# EAGLE design PCBArduino (EAGLE 9.4.2)
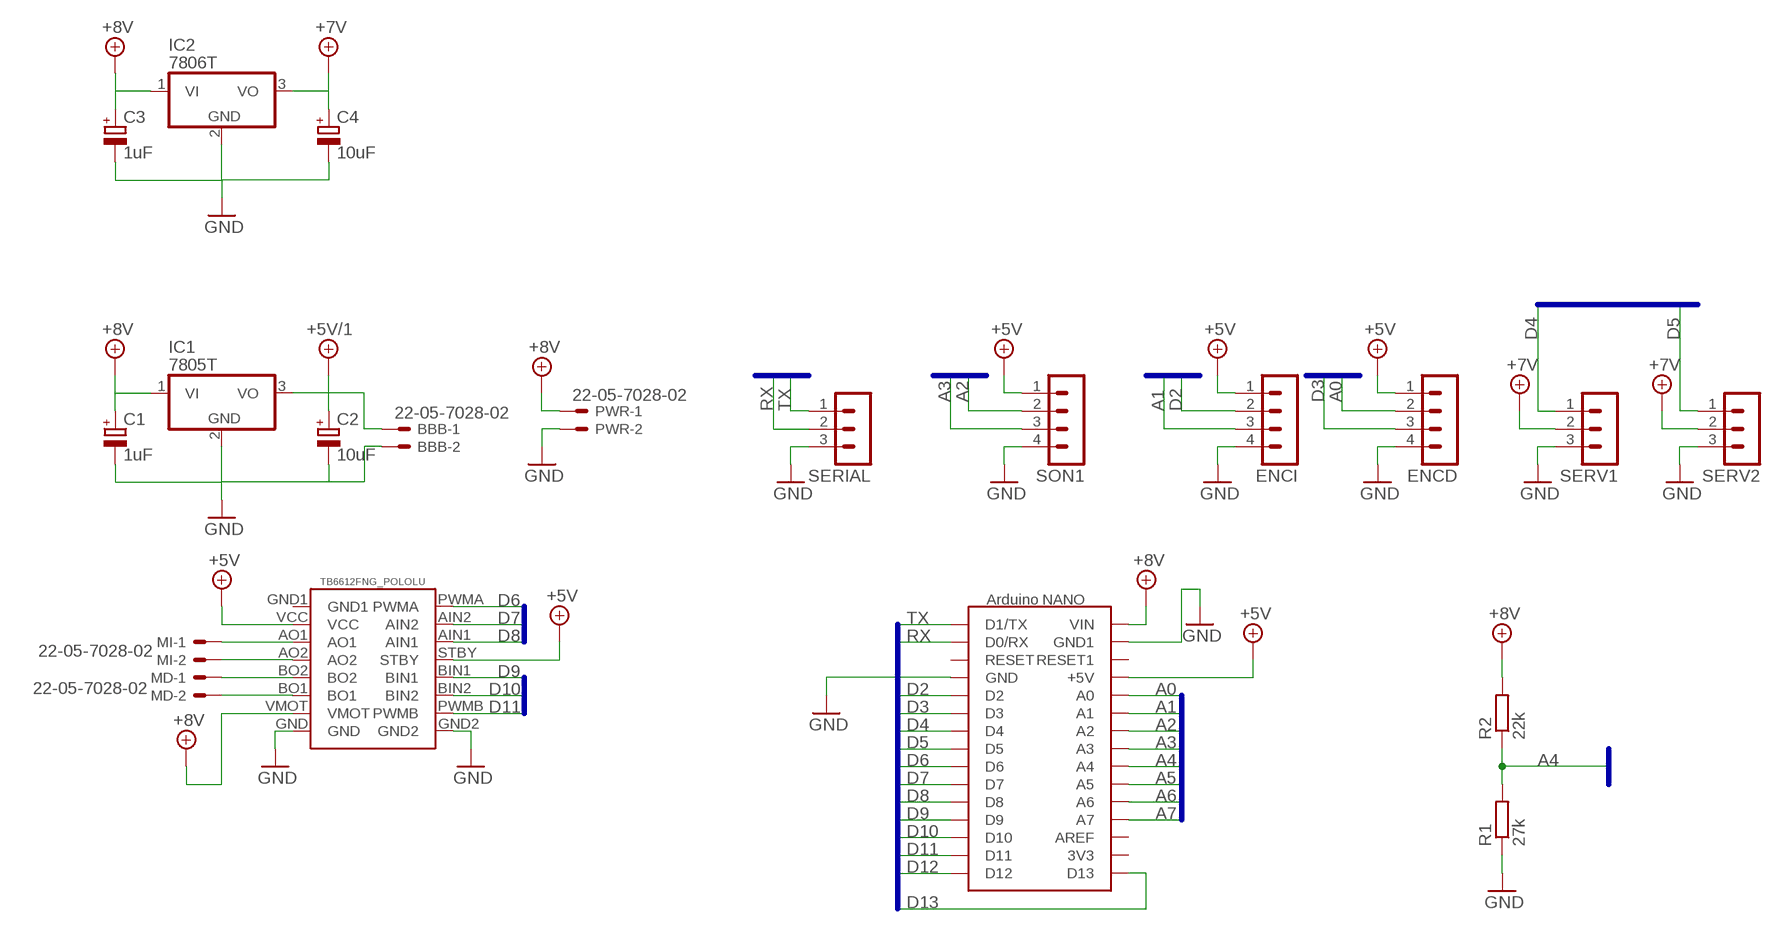
[diagram p0: schematic, sheet 1]

## Parts
BBB  22-05-7028-02  [7395-02]
C1  1uF  CPOL-EUE2.5-7  [E2,5-7]
C2  10uF  CPOL-EUE2.5-7  [E2,5-7]
C3  1uF  CPOL-EUE2.5-7  [E2,5-7]
C4  10uF  CPOL-EUE2.5-7  [E2,5-7]
ENCD  MA04-1  [MA04-1]
ENCI  MA04-1  [MA04-1]
IC1  7805T  [TO220H]
IC2  7806T  [TO220H]
MD  22-05-7028-02  [7395-02]
MI  22-05-7028-02  [7395-02]
PWR  22-05-7028-02  [7395-02]
R1  27k  R-EU_0204/5  [0204/5]
R2  22k  R-EU_0204/5  [0204/5]
SERIAL  MA03-1  [MA03-1]
SERV1  MA03-1  [MA03-1]
SERV2  MA03-1  [MA03-1]
SON1  MA04-1  [MA04-1]
U$1  ARDUINONANO  [PDIP-32]
U$2  TB6612FNG_POLOLU  [TB6612FNG_POLOLU]

## Nets
+5V: ENCD.1 ENCI.1 SON1.1 U$1.+5V U$2.STBY U$2.VCC
+5V/1: BBB.1 C2.+ IC1.3(VO)
+7V: C4.+ IC2.3(VO) SERV1.2 SERV2.2
+8V: C1.+ C3.+ IC1.1(VI) IC2.1(VI) PWR.1 R2.2 U$1.VIN U$2.VMOT
A0: ENCD.2 U$1.A0
A1: ENCI.3 U$1.A1
A2: SON1.2 U$1.A2
A3: SON1.3 U$1.A3
A4: R1.2 R2.1 U$1.A4
A5: U$1.A5
A6: U$1.A6
A7: U$1.A7
D2: ENCI.2 U$1.D2
D3: ENCD.3 U$1.D3
D4: SERV1.1 U$1.D4
D5: SERV2.1 U$1.D5
D6: U$1.D6 U$2.PWMA
D7: U$1.D7 U$2.AIN2
D8: U$1.D8 U$2.AIN1
D9: U$1.D9 U$2.BIN1
D10: U$1.D10 U$2.BIN2
D11: U$1.D11 U$2.PWMB
D12: U$1.D12
D13: U$1.D13
GND: BBB.2 C1.- C2.- C3.- C4.- ENCD.4 ENCI.4 IC1.2(GND) IC2.2(GND) PWR.2 R1.1 SERIAL.3 SERV1.3 SERV2.3 SON1.4 U$1.GND U$1.GND1 U$2.GND U$2.GND2
N$1: MI.1 U$2.AO1
N$2: MI.2 U$2.AO2
N$3: MD.1 U$2.BO2
N$4: MD.2 U$2.BO1
RX: SERIAL.2 U$1.D0/RX
TX: SERIAL.1 U$1.D1/TX
Unconnected: U$1.3V3 U$1.AREF U$1.RESET U$1.RESET1 U$2.GND1

## Buses
TX,RX,D2,D3,D4,D5,D6,D7,D8,D9,D10,D11,D12,D13,A0,A1,A2,A3,A4,A5,A6,A7
A0,A1,A2,A3,A4,A5,A6,A7

## Library data of the parts
BBB MD MI PWR = con-molex:22-?-02: CONNECTOR wire to board 2.54 mm (.1 inch) pitch header; OC_FARNELL: 9731601; OC_NEWARK: unknown
C1-C4 = rcl:CPOL-EU: POLARIZED CAPACITOR, European symbol
ENCD ENCI SON1 = con-lstb:MA04-1: PIN HEADER; OC_FARNELL: unknown; OC_NEWARK: unknown
IC1 IC2 = linear:78*: Positive VOLTAGE REGULATOR Source: http://cache.national.com/ds/LM/LM78L05.pdf http://www.fairchildsemi.com/ds/LM/LM7805.pdf
R1 R2 = rcl:R-EU_: RESISTOR, European symbol
SERIAL SERV1 SERV2 = con-lstb:MA03-1: PIN HEADER; OC_FARNELL: unknown; OC_NEWARK: unknown
U$1 = jet-lib:ARDUINONANO
U$2 = Crofi_UNAM_2014-11-17:TB6612FNG_POLOLU

## Board
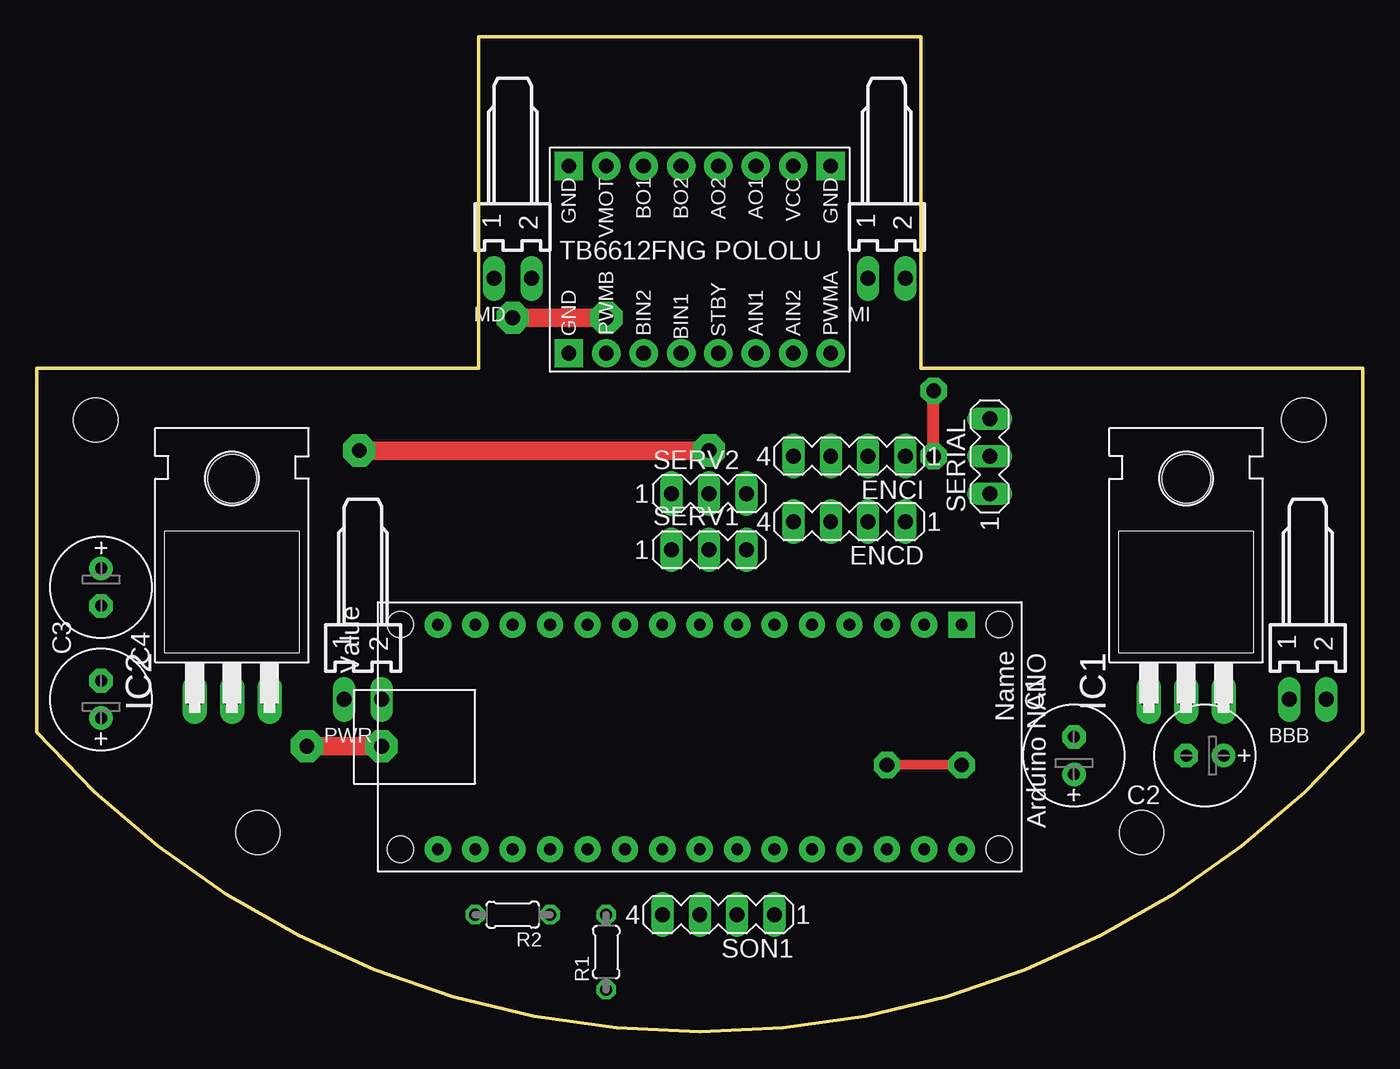
[diagram p1: board, top side]
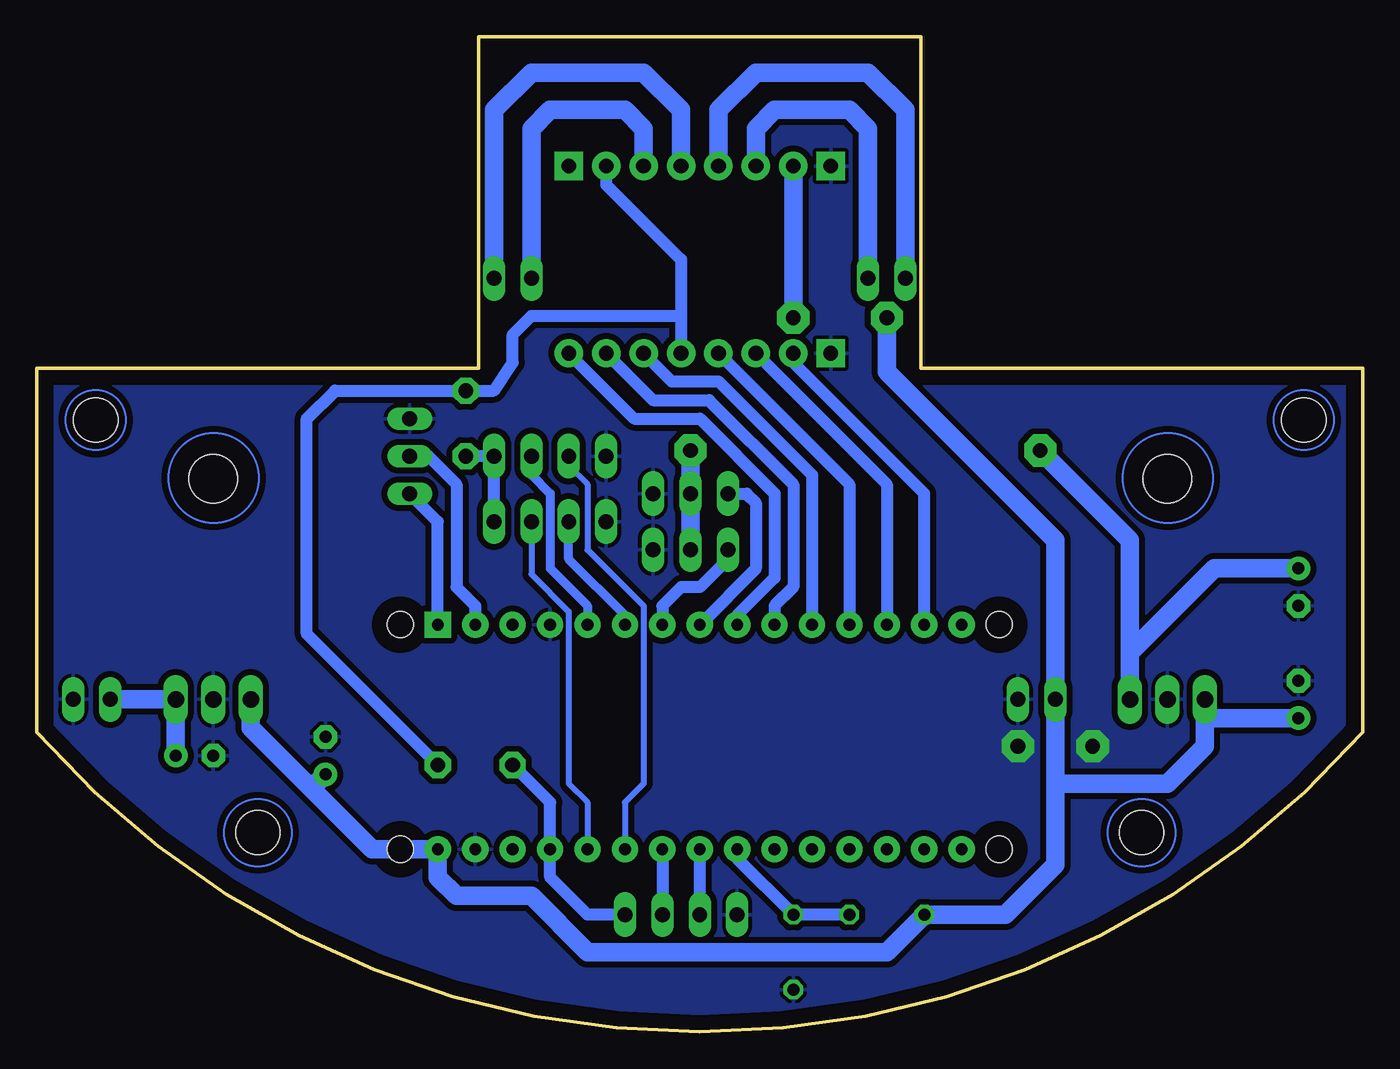
[diagram p2: board, bottom side, seen from below]

Size 90 x 67.52 mm. Coordinates in mm from the lower left corner, seen from the top.
Outline: 0,20.32 0,45.02 30,45.02 30,67.52 60,67.52 60,45.02 90,45.02 90,20.32 arc-97 0,20.32
Copper layers (1*16): Top 0.035mm / dielectric 1.5mm / Bottom 0.035mm
Design rules "default": minimum track width 10mil, minimum drill 24mil, track to track 8mil, track to pad 8mil, pad to pad 8mil, via to via 8mil, smd to smd 8mil, copper to edge 40mil, drill to drill 8mil, minimum pad ring 10mil, minimum via ring 8mil, stop-mask expansion 4mil, vias tented up to drill 0mil, thermal gap 10mil
Holes 3 mm at 15,13.52 4,41.52 86,41.52 75,13.52

### Footprints (pad centres in the part's own frame; a part is rotated, then mirrored left to right if it is on the bottom)
7395-02 = drill 1.016 long: 1 1.27,0; 2 -1.27,0
E2,5-7 = drill 0.813 pad 1.6: + -1.27,0 | drill 0.813 pad 1.6 octagon: - 1.27,0
MA04-1 = drill 1.016 long: 1 -3.81,0; 2 -1.27,0; 3 1.27,0; 4 3.81,0
TO220H = drill 1.118 long: 1 -2.54,-10.16; 2 0,-10.16; 3 2.54,-10.16 | hole 3.302: 0,4.826
0204/5 = drill 0.813 octagon: 1 -2.54,0; 2 2.54,0
MA03-1 = drill 1.016 long: 1 -2.54,0; 2 0,0; 3 2.54,0
PDIP-32 = drill 0.8 pad 1.778: 3V3 15.24,-35.56; +5V 15.24,-10.16; A0 15.24,-12.7; A1 15.24,-15.24; A2 15.24,-17.78; A3 15.24,-20.32; A4 15.24,-22.86; A5 15.24,-25.4; A6 15.24,-27.94; A7 15.24,-30.48; AREF 15.24,-33.02; D0/RX 0,-5.08; D2 0,-12.7; D3 0,-15.24; D4 0,-17.78; D5 0,-20.32; D6 0,-22.86; D7 0,-25.4; D8 0,-27.94; D9 0,-30.48; D10 0,-33.02; D11 0,-35.56; D12 0,-38.1; D13 15.24,-38.1; GND 0,-10.16; GND1 15.24,-5.08; RESET 0,-7.62; RESET1 15.24,-7.62; VIN 15.24,-2.54 | drill 0.8 pad 1.778 square: D1/TX 0,-2.54 | hole 1.778: 0,0; 0,-40.64; 15.24,-40.64; 15.24,0
TB6612FNG_POLOLU = drill 1 pad 1.93: AIN1 13.97,13.97; AIN2 13.97,16.51; AO1 1.27,13.97; AO2 1.27,11.43; BIN1 13.97,8.89; BIN2 13.97,6.35; BO1 1.27,6.35; BO2 1.27,8.89; PWMA 13.97,19.05; PWMB 13.97,3.81; STBY 13.97,11.43; VCC 1.27,16.51; VMOT 1.27,3.81 | drill 1 pad 1.93 square: GND 1.27,1.27; GND1 1.27,19.05; GND2 13.97,1.27

### Placement (x,y rotation side)
BBB  86.28,22.55 180 top
C1  70.4,18.74 90 top
C2  79.29,18.74 180 top
C3  4.36,22.55 90 top
C4  4.36,30.17 270 top
ENCD  55.16,34.62 180 top
ENCI  55.16,39.06 180 top
IC1  78.02,32.71 0 top
IC2  13.25,32.71 0 top
MD  32.3,51.13 180 top
MI  57.7,51.13 180 top
PWR  22.14,22.55 180 top
R1  38.65,5.41 90 top
R2  32.3,7.95 180 top
SERIAL  64.69,39.06 90 top
SERV1  45.63,32.71 0 top
SERV2  45.63,36.52 0 top
SON1  46.27,7.95 180 top
U$1  65.32,27.63 270 top
U$2  34.84,60.02 270 top

### Tracks (layer width: path | path; a pad name or v marks a point on that pad's centre or on a via)
+5V  (via drill 1 pad 1.78)
  Top 0.635: v57.7,18.11 v62.78,18.11
  Top 0.813: v60.88,39.06 v60.88,43.51
  Bottom 0.813: SON1.1 52.62,7.95 55.16,10.49 U$1.+5V 55.16,15.57 v57.7,18.11 | U$2.VCC 51.35,57.48 46.27,52.4 46.27,48.59 | 46.27,48.59 U$2.STBY | v62.78,18.11 71.67,27 71.67,41.6 69.77,43.51 v60.88,43.51 58.97,43.51 57.7,45.41 57.7,47.32 56.43,48.59 46.27,48.59 | ENCD.1 ENCI.1 v60.88,39.06
+5V/1
  Bottom 1.27: BBB.1 IC1.3 C2.+
+7V  (via drill 1 pad 2.18)
  Top 1.27: v21.89,39.44 v45.63,39.44
  Bottom 1.27: C4.+ 10.08,31.44 15.79,25.73 | 15.79,25.73 IC2.3 | 15.79,25.73 15.79,33.35 v21.89,39.44 | SERV1.2 SERV2.2 v45.63,39.44
+8V  (via drill 1 pad 2.18)
  Top 1.27: v32.3,48.46 v38.65,48.46
  Bottom 1.27: v32.3,48.46 32.3,44.78 20.87,33.35 PWR.1 20.87,16.84 | v38.65,48.46 U$2.VMOT | IC1.1 75.48,20.65 71.67,16.84 | 71.67,16.84 67.22,12.39 U$1.VIN 62.78,10.49 61.51,9.22 56.43,9.22 52.62,5.41 32.3,5.41 R2.2 24.26,7.95 20.87,11.34 20.87,16.84 | C1.+ 71.03,16.84 71.67,16.84 | C3.+ 10.71,21.28 | 20.87,16.84 13.25,16.84 10.71,19.38 10.71,21.28 | 10.71,21.28 IC2.1
A0
  Bottom 0.406: U$1.A0 52.62,15.57 53.89,16.84 53.89,28.52 56.43,31.06 ENCD.2
A1
  Bottom 0.406: U$1.A1 50.08,15.57 48.81,16.84 48.81,28.9 52.62,32.71 52.62,37.16 53.89,38.43 ENCI.3
A2
  Bottom 0.813: U$1.A2 SON1.2
A3
  Bottom 0.813: SON1.3 U$1.A3
A4
  Bottom 0.813: R2.1 R1.2 42.46,11.76 U$1.A4
D2
  Bottom 0.61: ENCI.2 56.43,37.79 55.16,36.52 55.16,31.44 52.62,28.9 U$1.D2
D3
  Bottom 0.61: U$1.D3 50.08,28.27 53.89,32.08 ENCD.3
D4
  Bottom 0.813: SERV1.1 43.09,32.08 45,30.17 46.27,30.17 47.54,28.9 U$1.D4
D5
  Bottom 0.813: SERV2.1 41.83,36.52 41.19,35.89 41.19,31.44 U$1.D5
D6
  Bottom 0.813: U$2.PWMA 49.45,41.6 45,41.6 39.92,36.52 39.92,30.81 42.46,28.27 U$1.D6
D7
  Bottom 0.813: U$2.AIN2 48.17,42.87 44.37,42.87 38.65,37.16 38.65,30.17 39.92,28.9 U$1.D7
D8
  Bottom 0.813: U$2.AIN1 46.91,44.14 43.73,44.14 37.38,37.79 U$1.D8
D9
  Bottom 0.813: U$2.BIN1 34.84,37.16 U$1.D9
D10
  Bottom 0.813: U$2.BIN2 32.3,37.16 U$1.D10
D11
  Bottom 0.813: U$1.D11 29.76,36.52 38.65,45.41 U$2.PWMB
GND  (via drill 1 pad 2.18)
  Top 1.27: v18.33,19.38 v23.41,19.38
  pour Bottom (isolate 0.406): -0.72,68.91 90.72,68.91 90.72,-0.94 -0.72,-0.94
N$1
  Bottom 1.27: U$2.AO1 48.81,61.29 50.08,62.56 55.16,62.56 56.43,61.29 MI.1
N$2
  Bottom 1.27: MI.2 58.97,62.56 56.43,65.1 48.81,65.1 46.27,62.56 U$2.AO2
N$3
  Bottom 1.27: U$2.BO2 43.73,62.56 41.19,65.1 33.57,65.1 31.03,62.56 MD.1
N$4
  Bottom 1.27: MD.2 33.57,61.29 34.84,62.56 39.92,62.56 41.19,61.29 U$2.BO1
RX
  Bottom 0.813: SERIAL.2 63.41,39.06 61.51,37.16 61.51,30.17 60.24,28.9 U$1.D0/RX
TX
  Bottom 0.813: U$1.D1/TX 62.78,34.62 SERIAL.1
(copper drawn outside any net)
  shapes: Bottom circle x6